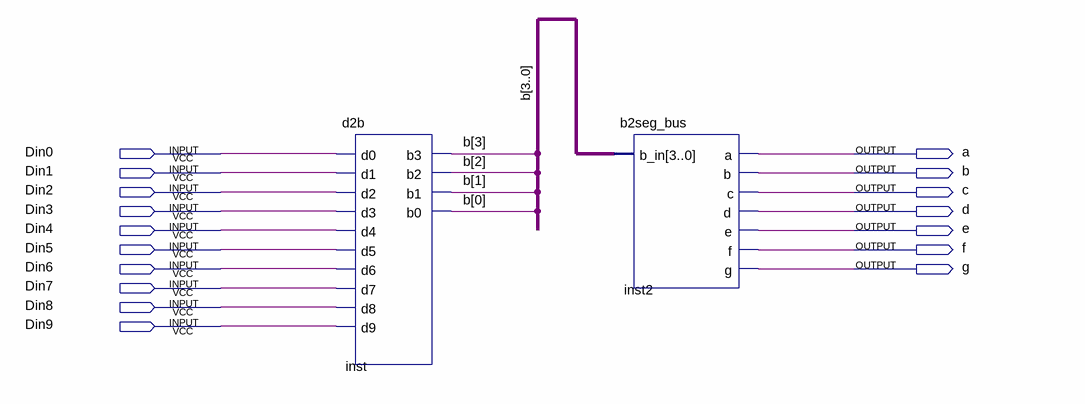
[diagram p0: schematic sheet]
// Quartus schematic nine_week_1.bdf as structural Verilog: 2 symbols, 17 pins
module nine_week_1 (
  input  Din0,
  input  Din1,
  input  Din2,
  input  Din3,
  input  Din4,
  input  Din5,
  input  Din6,
  input  Din7,
  input  Din8,
  input  Din9,
  output a,
  output b,
  output c,
  output d,
  output e,
  output f,
  output g
);

  wire [3:0] b_bus;

  d2b inst (
    .d0(Din0), .d1(Din1), .d2(Din2), .d3(Din3), .d4(Din4), .d5(Din5), .d6(Din6), .d7(Din7), .d8(Din8),
    .d9(Din9), .b3(b_bus[3]), .b2(b_bus[2]), .b1(b_bus[1]), .b0(b_bus[0]));
  b2seg_bus inst2 (.b_in(b_bus), .a(a), .b(b), .c(c), .d(d), .e(e), .f(f), .g(g));
endmodule
